# EAGLE schematic Brain_0.1.rv1 (EAGLE 9.6.2)
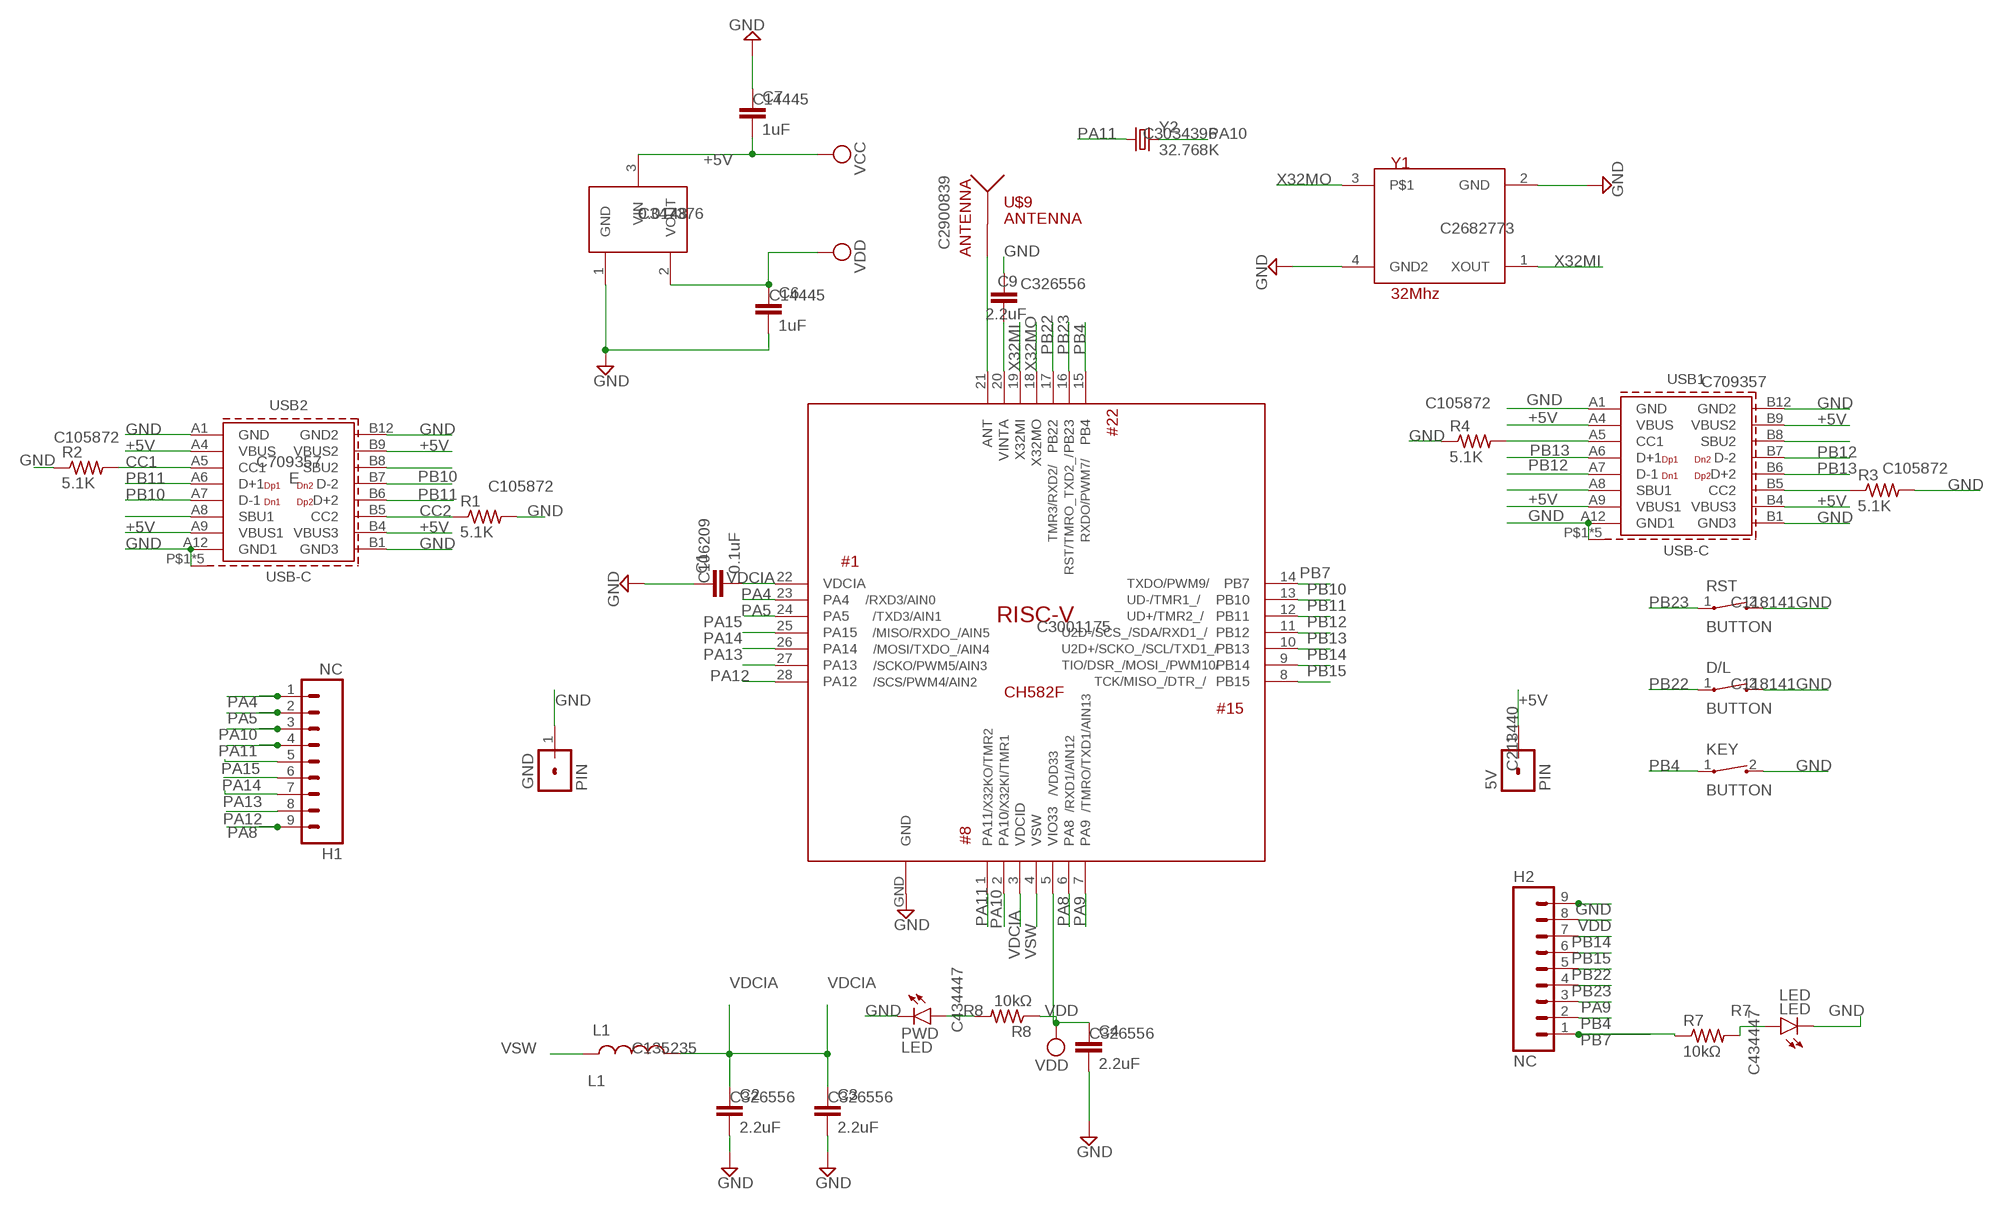
[diagram p0: schematic, sheet 1]

## Parts
5V  PIN  [1X01]
C1  0.1uF  C  [C1]
C2  2.2uF  C  [C1]
C3  2.2uF  C  [C1]
C4  2.2uF  C  [C1]
C6  1uF  C  [C1]
C7  1uF  C  [C1]
C9  2.2uF  C  [C1]
D/L  BUTTON  [SOD8037X250N]
GND  PIN  [1X01]
H1  NC  H  [61300911821]
H2  NC  H  [61300911821]
KEY  BUTTON  [SOD8037X250N]
L1  L1  [RESC3025X120N]
LED  LED  [CAPCP1005X40N]
PWD  LED  [CAPCP1005X40N]
R1  5.1K  RR0402  [R0402]
R2  5.1K  RR0402  [R0402]
R3  5.1K  RR0402  [R0402]
R4  5.1K  RR0402  [R0402]
R7  10kΩ  RR0402  [R0402]
R8  10kΩ  RR0402  [R0402]
RST  BUTTON  [SOD8037X250N]
U1  U1  [SOT95P240X90-3N]
U$8  RISC-V  [QFN40P400X400X75-29T280N]
U$9  ANTENNA  [CAPCP3015X50N]
USB1  629722000214  J1  [629722000214]
USB2  629722000214  J1  [629722000214]
Y1  Y1YSX211SL  [OSCCC200X160X50N]
Y2  32.768K  Y2  [XTAL700X315X230N]

## Nets
+5V: 5V.1 C7.2 U1.3(VIN) USB1.A4(VBUS) USB1.A9(VBUS1) USB1.B4(VBUS3) USB1.B9(VBUS2) USB2.A4(VBUS) USB2.A9(VBUS1) USB2.B4(VBUS3) USB2.B9(VBUS2) ; supply symbol labelled VCC
CC1: R2.2 USB2.A5(CC1)
CC2: R1.1 USB2.B5(CC2)
GND: C1.1 C2.2 C3.2 C4.2 C6.2 C7.1 C9.1 D/L.2 GND.1 H2.9 KEY.2 LED.C PWD.C R1.2 R2.1 R3.2 R4.1 RST.2 U1.1(GND) U$8.GND USB1.A1(GND) USB1.A12(GND1) USB1.B1(GND3) USB1.B12(GND2) USB1.P$1(SHIELD) USB1.S1(SHIELD) USB1.S2(SHIELD) USB1.S3(SHIELD) USB1.S4(SHIELD) USB2.A1(GND) USB2.A12(GND1) USB2.B1(GND3) USB2.B12(GND2) USB2.P$1(SHIELD) USB2.S1(SHIELD) USB2.S2(SHIELD) USB2.S3(SHIELD) USB2.S4(SHIELD) Y1.2(GND) Y1.4(GND2)
N$1: U$8.21(ANT) U$9.1
N$2: C9.2 U$8.20(VINTA)
N$3: USB1.B8(SBU2)
N$4: R3.1 USB1.B5(CC2)
N$6: USB2.A8(SBU1)
N$11: USB2.B8(SBU2)
N$13: R4.2 USB1.A5(CC1)
N$16: USB1.A8(SBU1)
PA4: H1.1 U$8.23(PA4)
PA5: H1.2 U$8.24(PA5)
PA8: H1.9 U$8.6(PA8)
PA9: H2.3 U$8.7(PA9)
PA10: H1.3 U$8.2(PA10) Y2.2
PA11: H1.4 U$8.1(PA11) Y2.1
PA12: H1.8 U$8.28(PA12)
PA13: H1.7 U$8.27(PA13)
PA14: H1.6 U$8.26(PA14)
PA15: H1.5 U$8.25(PA15)
PB4: H2.2 KEY.1 U$8.15(PB4)
PB7: H2.1 R7.1 U$8.14(PB7)
PB10: U$8.13(PB10) USB2.A7(D-1) USB2.B7(D-2)
PB11: U$8.12(PB11) USB2.A6(D+1) USB2.B6(D+2)
PB12: U$8.11(PB12) USB1.A7(D-1) USB1.B7(D-2)
PB13: U$8.10(PB13) USB1.A6(D+1) USB1.B6(D+2)
PB14: H2.7 U$8.9(PB14)
PB15: H2.6 U$8.8(PB15)
PB22: D/L.1 H2.5 U$8.17(PB22)
PB23: H2.4 RST.1 U$8.16(PB23)
R7: LED.A R7.2
R8: PWD.A R8.2
VDCIA: C1.2 C2.1 C3.1 L1.2 U$8.3(VDCID) U$8.22(VDCIA)
VDD: C4.1 C6.1 H2.8 R8.1 U1.2(VOUT) U$8.5(VIO33)
VSW: L1.1 U$8.4(VSW)
X32MI: U$8.19(X32MI) Y1.1(XOUT)
X32MO: U$8.18(X32MO) Y1.3
Unconnected: U$9.2

## Library data of the parts
5V GND = CH582M:PIN; LCSC: C213440
C1 = CH582M:C: CAPACITOR naming: grid - package width; LCSC: C106209; PRICE-1: 0.0014; PRICE-100: 0.0014; PRICE-1000: 0.0011
C2-C4 = CH582M:C: CAPACITOR naming: grid - package width; LCSC: C326556; PRICE-1: 0.0176; PRICE-100: 0.0176; PRICE-1000: 0.0148
C6 C7 = CH582M:C: CAPACITOR naming: grid - package width; LCSC: C14445; PRICE-1: 0.0018; PRICE-100: 0.0018; PRICE-1000: 0.0014
C9 = CH582M:C: CAPACITOR naming: grid - package width; LCSC: C326556; PRICE-1: 0.0167; PRICE-100: 0.0167; PRICE-1000: 0.0136
D/L KEY RST = CH582M:BUTTON; LCSC: C118141; PRICE-1: 0.069; PRICE-100: 0.0575; PRICE-1000: 0.0475
H1 H2 = CH582M:H
L1 = CH582M:L1; LCSC: C135235; PRICE-1: 0.0590; PRICE-100: 0.0487; PRICE-1000: 0.0358
LED PWD = CH582M:LED: LED OSRAM: - CHIPLED LG R971, LG N971, LY N971, LG Q971, LY Q971, LO R971, LY R971 LH N974, LH R974 LS Q976, LO Q976, LY Q976 LO Q996 - Hyper CHIPLED LW Q18S LB Q993, LB Q99A, LB R99A - SideLED LS A670, LO A670, LY A670, LG A670, LP A670 LB A673, LV A673, LT A673, LW A673 LH A674 LY A675 LS A676, LA A676, LO A676, LY A676, LW A676 LS A679, LY A679, LG A679 - Hyper Micro SIDELED® LS Y876, LA Y876, LO Y876, LY Y876 LT Y87S - SmartLED LW L88C, LW L88S LB L89C, LB L89S, LG L890 LS L89K, LO L89K, LY L89K LS L896, LA L896, LO L896, LY L896 - TOPLED LS T670, LO T670, LY T670, LG T670, LP T670 LSG T670, LSP T670, LSY T670, LOP T670, LYG T670 LG T671, LOG T671, LSG T671 LB T673, LV T673, LT T673, LW T673 LH T674 LS T676, LA T676, LO T676, LY T676, LB T676, LH T676, LSB T676, LW T676 LB T67C, LV T67C, LT T67C, LS T67K, LO T67K, LY T67K, LW E67C LS E67B, LA E67B, LO E67B, LY E67B, LB E67C, LV E67C, LT E67C LW T67C LS T679, LY T679, LG T679 LS T770, LO T770, LY T770, LG T770, LP T770 LB T773, LV T773, LT T773, LW T773 LH T774 LS E675, LA E675, LY E675, LS T675 LS T776, LA T776, LO T776, LY T776, LB T776 LHGB T686 LT T68C, LB T68C - Hyper Mini TOPLED® LB M676 - Mini TOPLED Santana® LG M470 LS M47K, LO M47K, LY M47K Source: http://www.osram.convergy.de LUXEON: - LUMILED® LXK2-PW12-R00, LXK2-PW12-S00, LXK2-PW14-U00, LXK2-PW14-V00 LXK2-PM12-R00, LXK2-PM12-S00, LXK2-PM14-U00 LXK2-PE12-Q00, LXK2-PE12-R00, LXK2-PE12-S00, LXK2-PE14-T00, LXK2-PE14-U00 LXK2-PB12-K00, LXK2-PB12-L00, LXK2-PB12-M00, LXK2-PB14-N00, LXK2-PB14-P00, LXK2-PB14-Q00 LXK2-PR12-L00, LXK2-PR12-M00, LXK2-PR14-Q00, LXK2-PR14-R00 LXK2-PD12-Q00, LXK2-PD12-R00, LXK2-PD12-S00 LXK2-PH12-R00, LXK2-PH12-S00 LXK2-PL12-P00, LXK2-PL12-Q00, LXK2-PL12-R00 Source: www.luxeon.com KINGBRIGHT: KA-3528ASYC Source: www.kingbright.com; LCSC: C434447; PRICE-1: 0.0140; PRICE-100: 0.0140; PRICE-1000: 0.0111
R1-R4 = CH582M:R: RESISTOR, American symbol; LCSC: C105872; PRICE-1: 0.0006; PRICE-100: 0.0006; PRICE-1000: 0.0005; SPICEPREFIX: R
R7 R8 = CH582M:R: RESISTOR, American symbol; LCSC: C25744; PRICE-1: 0.0006; PRICE-100: 0.0006; PRICE-1000: 0.0004; SPICEPREFIX: R
U1 = CH582M:U1; LCSC: C347376; PRICE-1: 0.0219; PRICE-100: 0.0219; PRICE-1000: 0.0148
U$8 = CH582M:RISC-V: Model: CH582F Documentation: Datasheet <https://github.com/claudioolmedo/risc-v/blob/main/CH582F/documentation/CH582F-CH583DS1-datasheet.pdf> Desing by: claudioolmedo.com <https://claudioolmedo.com/contribute-at-scanfcode/>; LCSC: C3001175; PRICE-1: 1.031; PRICE-100: 0.6794; PRICE-1000: 0.6141
U$9 = CH582M:ANTENNA; LCSC: C2900839; PRICE-1: 0.0577; PRICE-100: 0.046; PRICE-1000: 0.0402
USB1 = CH582M:J1: USB-C Female; APPLICATION: USB 2.0; DATASHEET-URL: https://www.we-online.com/redexpert/spec/629722000214?ae; GERDER: Receptacle; INTERFACE-TYPE: Type C; IR: 5A; LCSC: C709357; MOUNT: SMT; PACKAGING: Tape and Reel; PART-NUMBER: 629722000214; PINS: 16; PRICE-1: 0.0767; PRICE-100: 0.062; PRICE-1000: 0.0446; TYPE: Horizontal; WORKING-VOLTAGE: 20V(AC)
USB2 = CH582M:J1: USB-C Female; APPLICATION: USB 2.0; DATASHEET-URL: https://www.we-online.com/redexpert/spec/629722000214?ae; E: 1; GERDER: Receptacle; INTERFACE-TYPE: Type C; IR: 5A; LCSC: C709357; MOUNT: SMT; PACKAGING: Tape and Reel; PART-NUMBER: 629722000214; PINS: 16; PRICE-1: 0.0767; PRICE-100: 0.062; PRICE-1000: 0.0446; TYPE: Horizontal; WORKING-VOLTAGE: 20V(AC)
Y1 = CH582M:Y1; LCSC: C2682773; PRICE-1: 0.1077; PRICE-100: 0.0871; PRICE-1000: 0.069
Y2 = CH582M:Y2; LCSC: C3034396; PRICE-1: 0.1254; PRICE-100: 0.1013; PRICE-1000: 0.0802